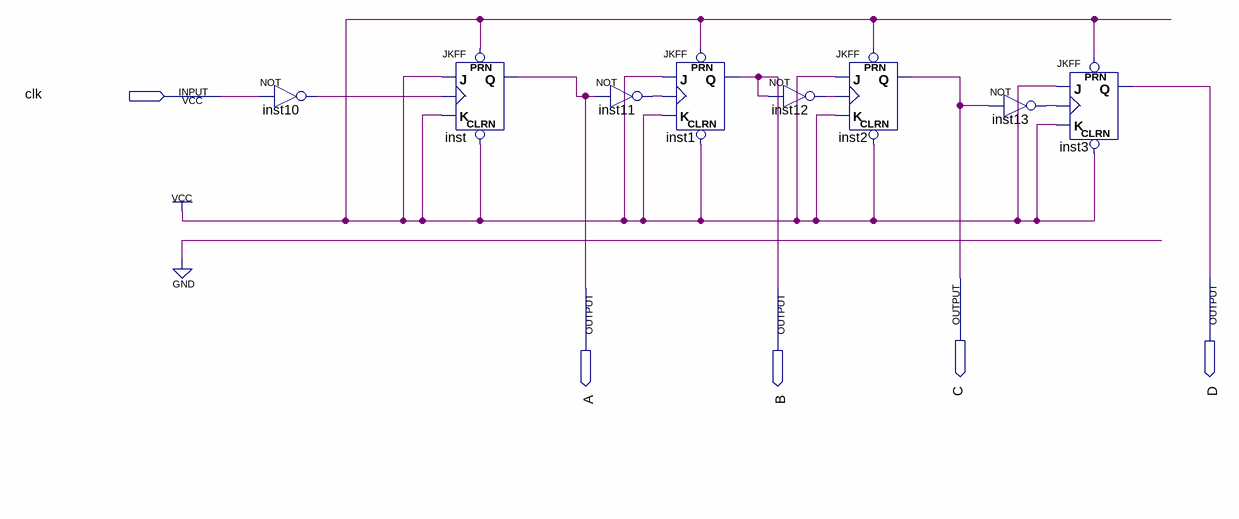
[diagram p0: schematic sheet]
// Quartus schematic lab10.bdf as structural Verilog: 8 symbols, 5 pins
module lab10 (
  input  clk,
  output C,
  output D,
  output A,
  output B
);

  wire inst10_out, inst11_out, inst12_out, inst13_out;

  not inst10 (inst10_out, clk);
  JKFF inst (.PRN(1'b1), .CLRN(1'b1), .K(1'b1), .J(1'b1), .CLK(inst10_out), .Q(A));
  not inst11 (inst11_out, A);
  JKFF inst1 (.PRN(1'b1), .CLRN(1'b1), .K(1'b1), .J(1'b1), .CLK(inst11_out), .Q(B));
  not inst12 (inst12_out, B);
  JKFF inst2 (.PRN(1'b1), .CLRN(1'b1), .K(1'b1), .J(1'b1), .CLK(inst12_out), .Q(C));
  not inst13 (inst13_out, C);
  JKFF inst3 (.PRN(1'b1), .CLRN(1'b1), .K(1'b1), .J(1'b1), .CLK(inst13_out), .Q(D));
endmodule
